# Altium schematic sheet Sheet1.SchDoc
size A4; SheetNumber: 1; SheetTotal: 1
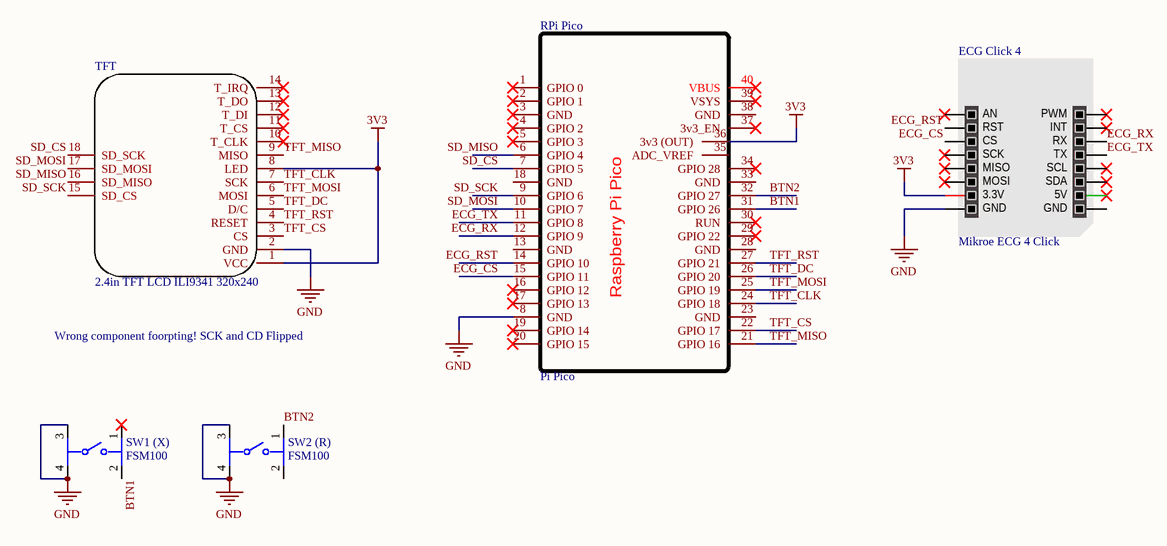
[diagram p0: Sheet1.SchDoc]

## Parts
ECG_Click_4  Mikroe ECG 4 Click  [Mikroe ECG 4 Click-Footprint-1]
RPi_Pico  Pi Pico  [Pi Pico-Footprint-1]
SW1_(X)  FSM100  [FP-FSM100-MFG]
SW2_(R)  FSM100  [FP-FSM100-MFG]
TFT  2.4in TFT LCD ILI9341 320x240  [2.4in TFT LCD ILI9341 320x240-Footprint-1]

## Nets
3V3: ECG_Click_4.7(3.3V) RPi_Pico.36(3v3_(OUT)) TFT.1(VCC) TFT.8(LED)
GND: ECG_Click_4.8(GND) RPi_Pico.8(GND) SW1_(X).3 SW1_(X).4 SW2_(R).3 SW2_(R).4 TFT.2(GND)
BTN1: RPi_Pico.31(GPIO_26) SW1_(X).2
BTN2: RPi_Pico.32(GPIO_27) SW2_(R).1
ECG_CS: ECG_Click_4.3(CS) RPi_Pico.15(GPIO_11)
ECG_RST: ECG_Click_4.2(RST) RPi_Pico.14(GPIO_10)
ECG_RX: ECG_Click_4.14(RX) RPi_Pico.12(GPIO_9)
ECG_TX: ECG_Click_4.13(TX) RPi_Pico.11(GPIO_8)
SD_CS: RPi_Pico.7(GPIO_5) TFT.18(SD_SCK)
SD_MISO: RPi_Pico.6(GPIO_4) TFT.16(SD_MISO)
SD_MOSI: RPi_Pico.10(GPIO_7) TFT.17(SD_MOSI)
SD_SCK: RPi_Pico.9(GPIO_6) TFT.15(SD_CS)
TFT_CLK: RPi_Pico.24(GPIO_18) TFT.7(SCK)
TFT_CS: RPi_Pico.22(GPIO_17) TFT.3(CS)
TFT_DC: RPi_Pico.26(GPIO_20) TFT.5(D/C)
TFT_MISO: RPi_Pico.21(GPIO_16) TFT.9(MISO)
TFT_MOSI: RPi_Pico.25(GPIO_19) TFT.6(MOSI)
TFT_RST: RPi_Pico.27(GPIO_21) TFT.4(RESET)

Not connected (* = marked no-connect by the designer): ECG_Click_4 1(AN)* 4(SCK)* 5(MISO)* 6(MOSI)* 9(GND) 10(5V)* 11(SDA)* 12(SCL)* 15(INT)* 16(PWM)*; RPi_Pico 1(GPIO_0)* 2(GPIO_1)* 3(GND)* 4(GPIO_2)* 5(GPIO_3)* 13(GND) 16(GPIO_12)* 17(GPIO_13)* 18(GND) 19(GPIO_14)* 20(GPIO_15)* 23(GND) 28(GND) 29(GPIO_22)* 30(RUN)* 33(GND) 34(GPIO_28)* 35(ADC_VREF) 37(3v3_EN)* 38(GND) 39(VSYS)* 40(VBUS)*; SW1_(X) 1*; SW2_(R) 2; TFT 10(T_CLK)* 11(T_CS)* 12(T_DI)* 13(T_DO)* 14(T_IRQ)*

## Notes on the sheet
- Wrong component foorpting! SCK and CD Flipped
- (in symbol CMP-00002-2) Raspberry Pi Pico

## Library data of the parts
ECG_Click_4 = CMP-00003-3
RPi_Pico = CMP-00002-2
SW1_(X) SW2_(R) = CMP-03402-000014-1: SWITCH TACTILE SPST-NO 0.05A 24V; Throw Configuration: SPST; Max Current Rating: 50mA; Switch Function: Off-Mom; Actuator Length: 6.35mm; Electrical Life: 100000Cycles; Max Voltage Rating (DC): 12V; Switch Travel: 0.3mm; Illumination Type: Non-Illuminated; Actuator Material: Polyester; Actuator Type: Standard; Actuator Color: Black; Contact Resistance: 100mR; Operating Force: 1.57N; Orientation: Straight; Contact Type: 1 maker; Current Rating: 50mA; Termination: PC Pins; Contact Current Rating: 50mA; Max Operating Temperature: 85°C; RoHS Compliant: Yes; Min Operating Temperature: -35°C; Contact Plating: Silver; Length: 12mm; Voltage Rating (DC): 24V; Type: Switch; Packaging: Loose Piece; Series: FSM100 ~ 104; Contact Material: Copper Alloy; Depth: 12.5mm; Lead Free: Lead Free; Mount: Through Hole; ELV: Compliant; Package Quantity: 400; Mechanical Life: 100000Cycles
TFT = CMP-00000-3